# Altium schematic sheet Transformer.SchDoc
size A3; SheetNumber: 39; SheetTotal: 41
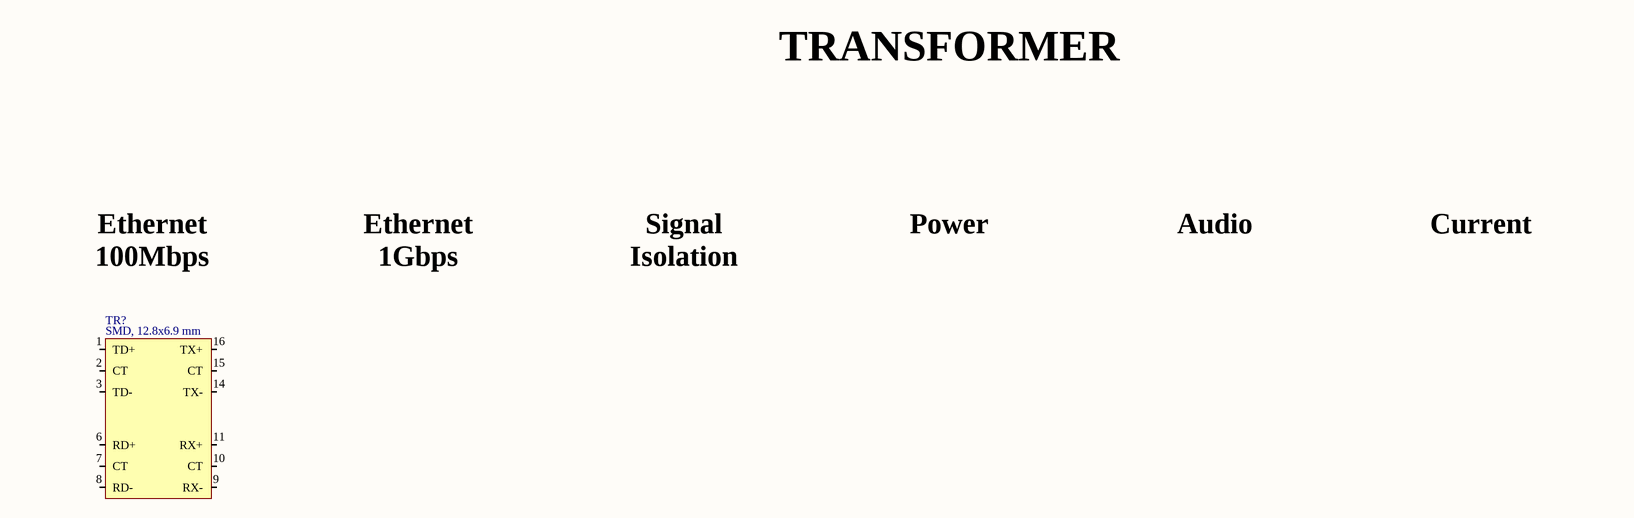
[diagram p0: Transformer.SchDoc]

## Parts
TR?  Package: SMD, 12.8x6.9 mm  [Transformer, Pulse - Bourns, SM13126PEL]  (hidden comment: Transformer, Pulse - Bourns, SM13126PEL)

## Nets

Not connected (* = marked no-connect by the designer): TR? 1(TD+) 2(CT) 3(TD-) 6(RD+) 7(CT) 8(RD-) 9(RX-) 10(CT) 11(RX+) 14(TX-) 15(CT) 16(TX+)

## Notes on the sheet
- TRANSFORMER
- Ethernet
  100Mbps
- Ethernet
  1Gbps
- Signal
  Isolation
- Power
- Audio
- Current

## Library data of the parts
TR? = Transformer, Pulse - Bourns, SM13126PEL: Transformer, Eth, 100Mbps, SM13126PEL; ComponentLink1Description: Datasheet; ComponentLink1URL: E:\Altium\Datasheets\Transformer\Transformer, Pulse - Bourns, SM51108PEL.pdf; ComponentLink2Description: Supplier Link; ComponentLink2URL: https://www.digikey.com/en/products/detail/bourns-inc/SM13126PEL/10229989; Manufacturer Part Number: SM13126PEL; Supplier: Digikey; Supplier Part Number: SM13126PELCT-ND; Manufacturer: Bourns; Operating Temperature, Min: -40℃; Operating Temperature, Max: +85℃; Quantity, Min: 1; Quantity, Max: 6000; Price, Min: 2.17; Price, Max: 1.05049; Supplier Currency: $; Supplier Link: https://www.digikey.com/en/products/detail/bourns-inc/SM13126PEL/10229989; Component Type: Pulse; Component Category: Transformer